# Altium schematic sheet Sensor.SchDoc
size A2
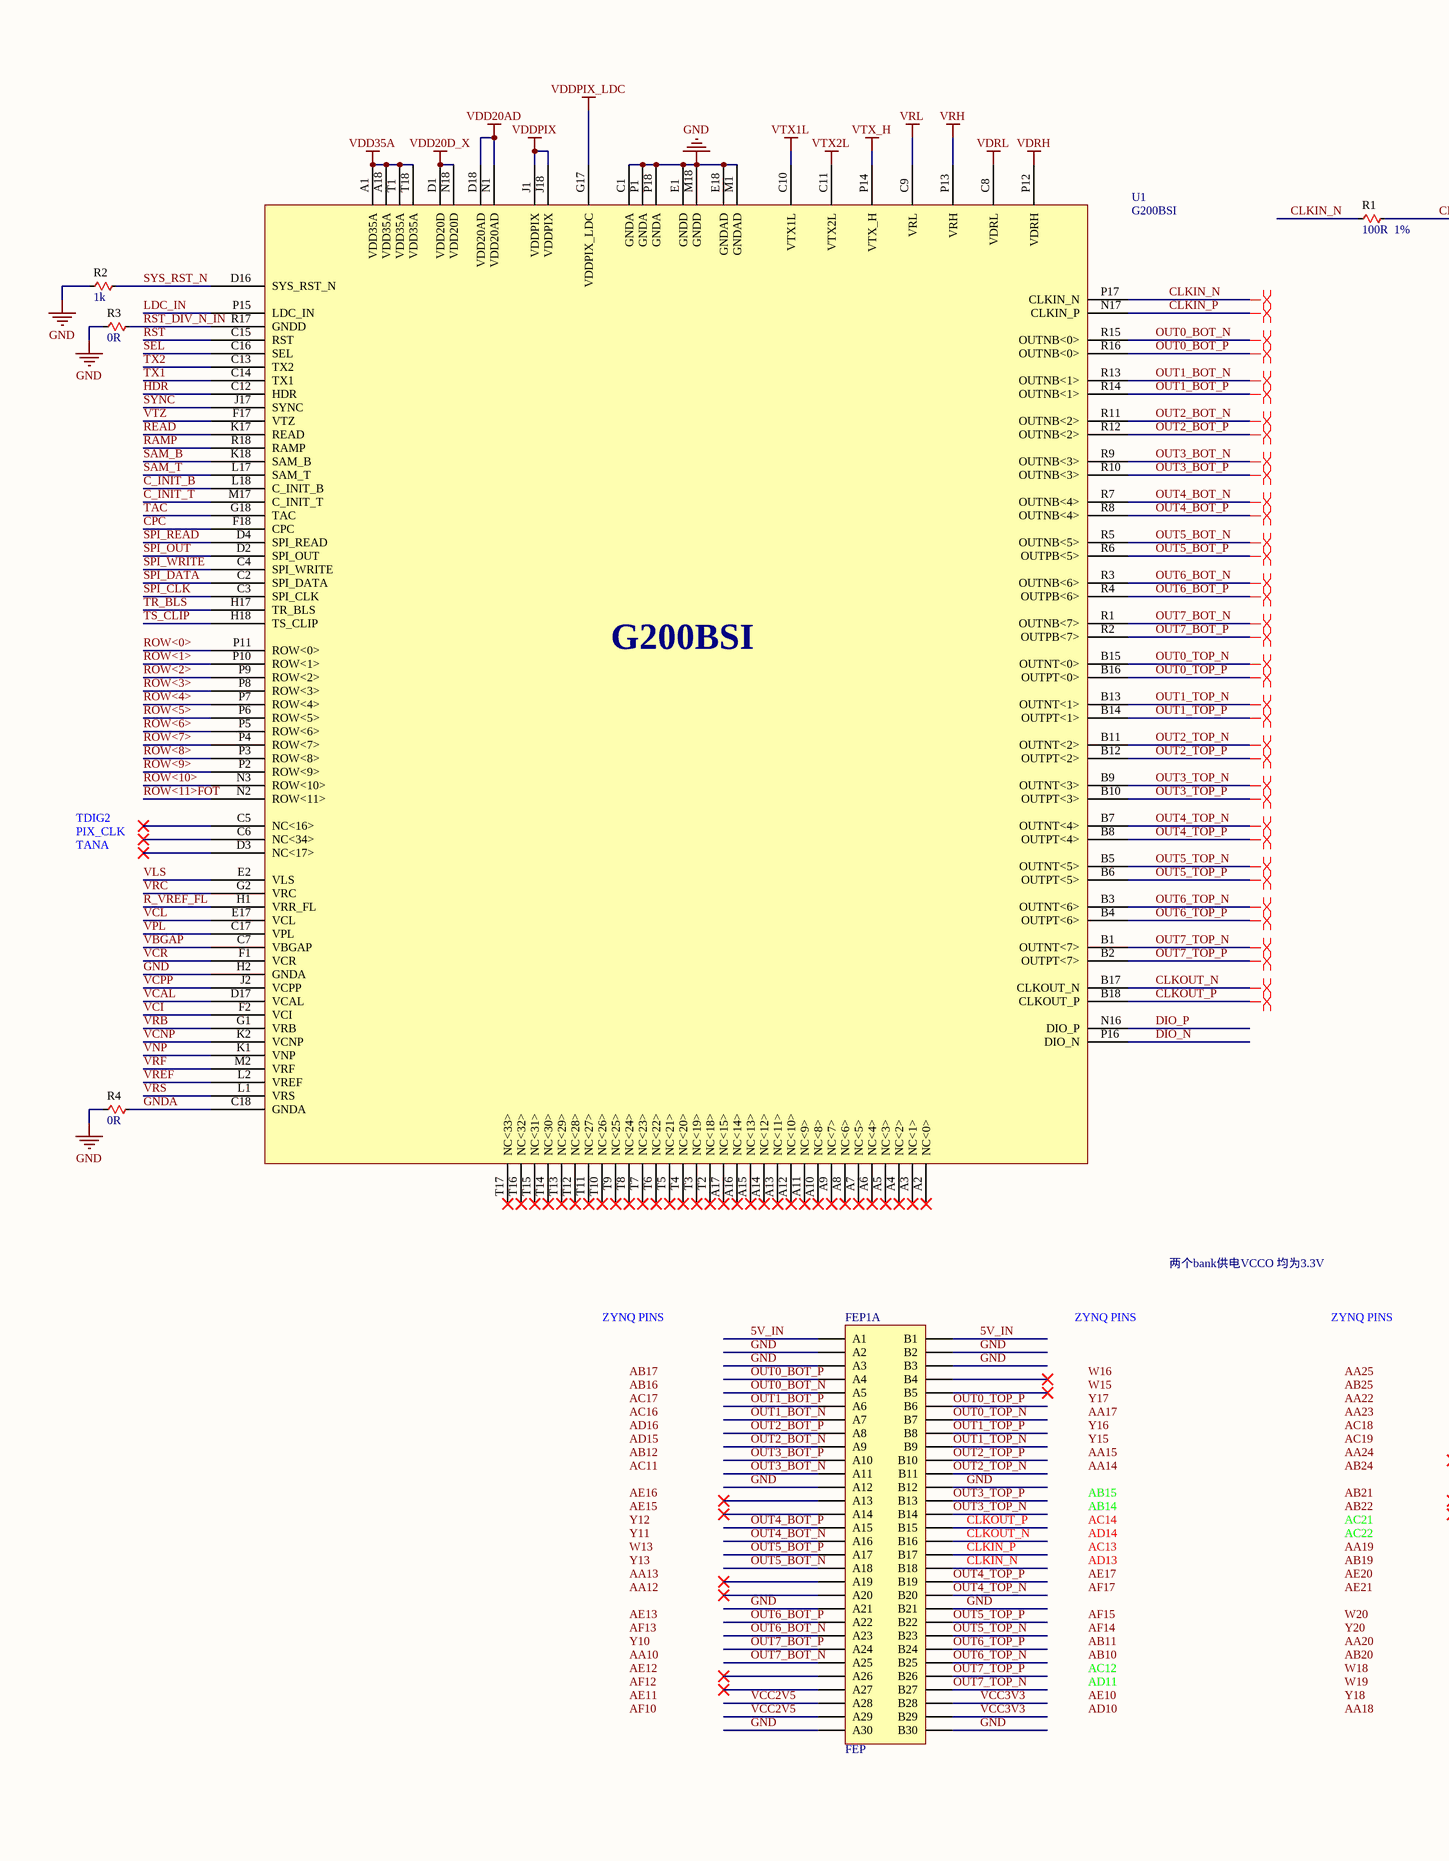
[diagram p0: Sensor.SchDoc, left]
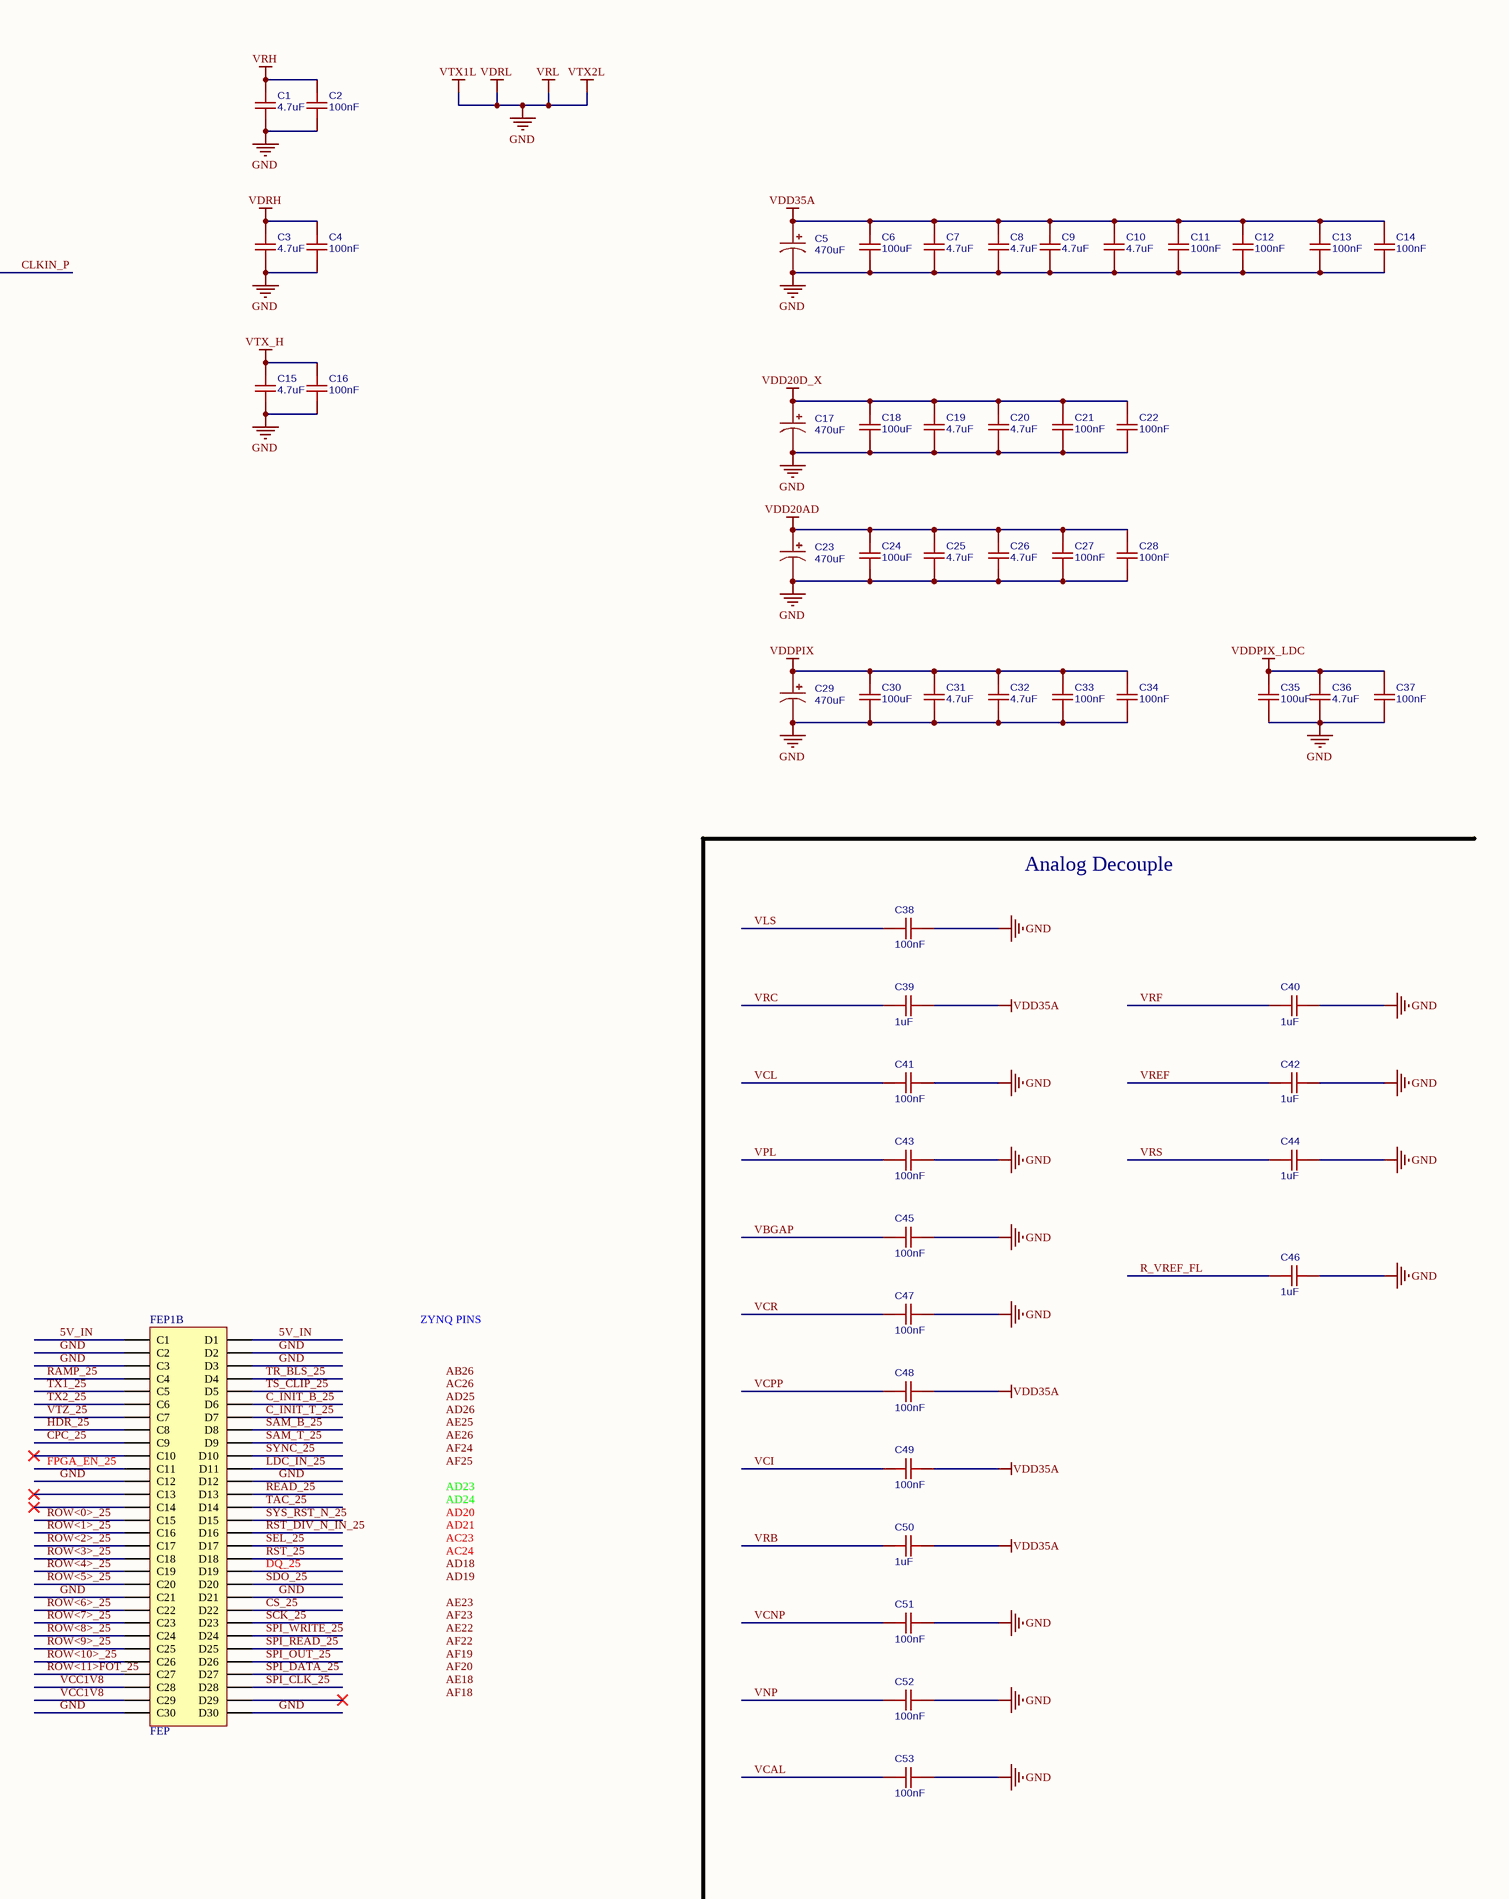
[diagram p1: Sensor.SchDoc, right]

## Parts
C1  4.7uF  [CAP0402]
C2  100nF  [CAP0402]
C3  4.7uF  [CAP0402]
C4  100nF  [CAP0402]
C5  470uF  [CASE-A_3216]
C6  100uF  [CAP0402]
C7  4.7uF  [CAP0402]
C8  4.7uF  [CAP0402]
C9  4.7uF  [CAP0402]
C10  4.7uF  [CAP0402]
C11  100nF  [CAP0402]
C12  100nF  [CAP0402]
C13  100nF  [CAP0402]
C14  100nF  [CAP0402]
C15  4.7uF  [CAP0402]
C16  100nF  [CAP0402]
C17  470uF  [CASE-A_3216]
C18  100uF  [CAP0402]
C19  4.7uF  [CAP0402]
C20  4.7uF  [CAP0402]
C21  100nF  [CAP0402]
C22  100nF  [CAP0402]
C23  470uF  [CASE-A_3216]
C24  100uF  [CAP0402]
C25  4.7uF  [CAP0402]
C26  4.7uF  [CAP0402]
C27  100nF  [CAP0402]
C28  100nF  [CAP0402]
C29  470uF  [CASE-A_3216]
C30  100uF  [CAP0402]
C31  4.7uF  [CAP0402]
C32  4.7uF  [CAP0402]
C33  100nF  [CAP0402]
C34  100nF  [CAP0402]
C35  100uF  [CAP0402]
C36  4.7uF  [CAP0402]
C37  100nF  [CAP0402]
C38  100nF  [CAP0402]
C39  1uF  [CAP0402]
C40  1uF  [CAP0402]
C41  100nF  [CAP0402]
C42  1uF  [CAP0402]
C43  100nF  [CAP0402]
C44  1uF  [CAP0402]
C45  100nF  [CAP0402]
C46  1uF  [CAP0402]
C47  100nF  [CAP0402]
C48  100nF  [CAP0402]
C49  100nF  [CAP0402]
C50  1uF  [CAP0402]
C51  100nF  [CAP0402]
C52  100nF  [CAP0402]
C53  100nF  [CAP0402]
FEP1  FEP  [FEP-X2]  (parts A,B of 3)
R1  100R  1%  [RES0402]
R2  1k  [RES0402]
R3  0R  [RES0402]
R4  0R  [RES0402]
U1  G200BSI  [ANDON Socket]

## Nets
GND: C1.1 C2.1 C3.1 C4.1 C5.2 C6.1 C7.1 C8.1 C9.1 C10.1 C11.1 C12.1 C13.1 C14.1 C15.1 C16.1 C17.2 C18.1 C19.1 C20.1 C21.1 C22.1 C23.2 C24.1 C25.1 C26.1 C27.1 C28.1 C29.2 C30.1 C31.1 C32.1 C33.1 C34.1 C35.1 C36.1 C37.1 C38.2 C40.2 C41.2 C42.2 C43.2 C44.2 C45.2 C46.2 C47.2 C51.2 C52.2 C53.2 FEP1.A2 FEP1.A3 FEP1.A12 FEP1.A21 FEP1.A30 FEP1.B2 FEP1.B3 FEP1.B12 FEP1.B21 FEP1.B30 FEP1.C2 FEP1.C3 FEP1.C12 FEP1.C21 FEP1.C30 FEP1.D2 FEP1.D3 FEP1.D12 FEP1.D21 FEP1.D30 R2.2 R3.2 R4.2 U1.C1(GNDA) U1.C8(VDRL) U1.C9(VRL) U1.C10(VTX1L) U1.C11(VTX2L) U1.E1(GNDD) U1.E18(GNDAD) U1.H2(GNDA) U1.M1(GNDAD) U1.M18(GNDD) U1.P1(GNDA) U1.P18(GNDA)  [also labelled VDRL, VRL, VTX1L, VTX2L]
VDD20AD: C23.1 C24.2 C25.2 C26.2 C27.2 C28.2 U1.D18(VDD20AD) U1.N1(VDD20AD)
VDD20D_X: C17.1 C18.2 C19.2 C20.2 C21.2 C22.2 U1.D1(VDD20D) U1.N18(VDD20D)
VDD35A: C5.1 C6.2 C7.2 C8.2 C9.2 C10.2 C11.2 C12.2 C13.2 C14.2 C39.2 C48.2 C49.2 C50.2 U1.A1(VDD35A) U1.A18(VDD35A) U1.T1(VDD35A) U1.T18(VDD35A)
VDDPIX: C29.1 C30.2 C31.2 C32.2 C33.2 C34.2 U1.J1(VDDPIX) U1.J18(VDDPIX)
VDDPIX_LDC: C35.2 C36.2 C37.2 U1.G17(VDDPIX_LDC)
VDRH: C3.2 C4.2 U1.P12(VDRH)
VRH: C1.2 C2.2 U1.P13(VRH)
VTX_H: C15.2 C16.2 U1.P14(VTX_H)
5V_IN: FEP1.A1 FEP1.B1 FEP1.C1 FEP1.D1
C_INIT_B: U1.L18(C_INIT_B)
C_INIT_B_25: FEP1.D6
C_INIT_T: U1.M17(C_INIT_T)
C_INIT_T_25: FEP1.D7
CLKIN_N: FEP1.B18 R1.2 U1.P17(CLKIN_N)
CLKIN_P: FEP1.B17 R1.1 U1.N17(CLKIN_P)
CLKOUT_N: FEP1.B16 U1.B17(CLKOUT_N)
CLKOUT_P: FEP1.B15 U1.B18(CLKOUT_P)
CPC: U1.F18(CPC)
CPC_25: FEP1.C9
CS_25: FEP1.D22
DIO_N: U1.P16(DIO_N)
DIO_P: U1.N16(DIO_P)
DQ_25: FEP1.D19
FPGA_EN_25: FEP1.C11
GNDA: R4.1 U1.C18(GNDA)
HDR: U1.C12(HDR)
HDR_25: FEP1.C8
LDC_IN: U1.P15(LDC_IN)
LDC_IN_25: FEP1.D11
OUT0_BOT_N: FEP1.A5 U1.R15(OUTNB<0>)
OUT0_BOT_P: FEP1.A4 U1.R16(OUTNB<0>)
OUT0_TOP_N: FEP1.B7 U1.B15(OUTNT<0>)
OUT0_TOP_P: FEP1.B6 U1.B16(OUTPT<0>)
OUT1_BOT_N: FEP1.A7 U1.R13(OUTNB<1>)
OUT1_BOT_P: FEP1.A6 U1.R14(OUTNB<1>)
OUT1_TOP_N: FEP1.B9 U1.B13(OUTNT<1>)
OUT1_TOP_P: FEP1.B8 U1.B14(OUTPT<1>)
OUT2_BOT_N: FEP1.A9 U1.R11(OUTNB<2>)
OUT2_BOT_P: FEP1.A8 U1.R12(OUTNB<2>)
OUT2_TOP_N: FEP1.B11 U1.B11(OUTNT<2>)
OUT2_TOP_P: FEP1.B10 U1.B12(OUTPT<2>)
OUT3_BOT_N: FEP1.A11 U1.R9(OUTNB<3>)
OUT3_BOT_P: FEP1.A10 U1.R10(OUTNB<3>)
OUT3_TOP_N: FEP1.B14 U1.B9(OUTNT<3>)
OUT3_TOP_P: FEP1.B13 U1.B10(OUTPT<3>)
OUT4_BOT_N: FEP1.A16 U1.R7(OUTNB<4>)
OUT4_BOT_P: FEP1.A15 U1.R8(OUTNB<4>)
OUT4_TOP_N: FEP1.B20 U1.B7(OUTNT<4>)
OUT4_TOP_P: FEP1.B19 U1.B8(OUTPT<4>)
OUT5_BOT_N: FEP1.A18 U1.R5(OUTNB<5>)
OUT5_BOT_P: FEP1.A17 U1.R6(OUTPB<5>)
OUT5_TOP_N: FEP1.B23 U1.B5(OUTNT<5>)
OUT5_TOP_P: FEP1.B22 U1.B6(OUTPT<5>)
OUT6_BOT_N: FEP1.A23 U1.R3(OUTNB<6>)
OUT6_BOT_P: FEP1.A22 U1.R4(OUTPB<6>)
OUT6_TOP_N: FEP1.B25 U1.B3(OUTNT<6>)
OUT6_TOP_P: FEP1.B24 U1.B4(OUTPT<6>)
OUT7_BOT_N: FEP1.A25 U1.R1(OUTNB<7>)
OUT7_BOT_P: FEP1.A24 U1.R2(OUTPB<7>)
OUT7_TOP_N: FEP1.B27 U1.B1(OUTNT<7>)
OUT7_TOP_P: FEP1.B26 U1.B2(OUTPT<7>)
R_VREF_FL: C46.1 U1.H1(VRR_FL)
RAMP: U1.R18(RAMP)
RAMP_25: FEP1.C4
READ: U1.K17(READ)
READ_25: FEP1.D13
ROW<0>: U1.P11(ROW<0>)
ROW<0>_25: FEP1.C15
ROW<1>: U1.P10(ROW<1>)
ROW<1>_25: FEP1.C16
ROW<2>: U1.P9(ROW<2>)
ROW<2>_25: FEP1.C17
ROW<3>: U1.P8(ROW<3>)
ROW<3>_25: FEP1.C18
ROW<4>: U1.P7(ROW<4>)
ROW<4>_25: FEP1.C19
ROW<5>: U1.P6(ROW<5>)
ROW<5>_25: FEP1.C20
ROW<6>: U1.P5(ROW<6>)
ROW<6>_25: FEP1.C22
ROW<7>: U1.P4(ROW<7>)
ROW<7>_25: FEP1.C23
ROW<8>: U1.P3(ROW<8>)
ROW<8>_25: FEP1.C24
ROW<9>: U1.P2(ROW<9>)
ROW<9>_25: FEP1.C25
ROW<10>: U1.N3(ROW<10>)
ROW<10>_25: FEP1.C26
ROW<11>FOT: U1.N2(ROW<11>)
ROW<11>FOT_25: FEP1.C27
RST: U1.C15(RST)
RST_25: FEP1.D18
RST_DIV_N_IN: R3.1 U1.R17(GNDD)
RST_DIV_N_IN_25: FEP1.D16
SAM_B: U1.K18(SAM_B)
SAM_B_25: FEP1.D8
SAM_T: U1.L17(SAM_T)
SAM_T_25: FEP1.D9
SCK_25: FEP1.D23
SDO_25: FEP1.D20
SEL: U1.C16(SEL)
SEL_25: FEP1.D17
SPI_CLK: U1.C3(SPI_CLK)
SPI_CLK_25: FEP1.D28
SPI_DATA: U1.C2(SPI_DATA)
SPI_DATA_25: FEP1.D27
SPI_OUT: U1.D2(SPI_OUT)
SPI_OUT_25: FEP1.D26
SPI_READ: U1.D4(SPI_READ)
SPI_READ_25: FEP1.D25
SPI_WRITE: U1.C4(SPI_WRITE)
SPI_WRITE_25: FEP1.D24
SYNC: U1.J17(SYNC)
SYNC_25: FEP1.D10
SYS_RST_N: R2.1 U1.D16(SYS_RST_N)
SYS_RST_N_25: FEP1.D15
TAC: U1.G18(TAC)
TAC_25: FEP1.D14
TR_BLS: U1.H17(TR_BLS)
TR_BLS_25: FEP1.D4
TS_CLIP: U1.H18(TS_CLIP)
TS_CLIP_25: FEP1.D5
TX1: U1.C14(TX1)
TX1_25: FEP1.C5
TX2: U1.C13(TX2)
TX2_25: FEP1.C6
VBGAP: C45.1 U1.C7(VBGAP)
VCAL: C53.1 U1.D17(VCAL)
VCC1V8: FEP1.C28 FEP1.C29
VCC2V5: FEP1.A28 FEP1.A29
VCC3V3: FEP1.B28 FEP1.B29
VCI: C49.1 U1.F2(VCI)
VCL: C41.1 U1.E17(VCL)
VCNP: C51.1 U1.K2(VCNP)
VCPP: C48.1 U1.J2(VCPP)
VCR: C47.1 U1.F1(VCR)
VLS: C38.1 U1.E2(VLS)
VNP: C52.1 U1.K1(VNP)
VPL: C43.1 U1.C17(VPL)
VRB: C50.1 U1.G1(VRB)
VRC: C39.1 U1.G2(VRC)
VREF: C42.1 U1.L2(VREF)
VRF: C40.1 U1.M2(VRF)
VRS: C44.1 U1.L1(VRS)
VTZ: U1.F17(VTZ)
VTZ_25: FEP1.C7

Not connected (* = marked no-connect by the designer): FEP1 A13* A14* A19* A20* A26* A27* B4* B5* C10* C13* C14* D29*; U1 A2(NC<0>)* A3(NC<1>)* A4(NC<2>)* A5(NC<3>)* A6(NC<4>)* A7(NC<5>)* A8(NC<6>)* A9(NC<7>)* A10(NC<8>)* A11(NC<9>)* A12(NC<10>)* A13(NC<11>)* A14(NC<12>)* A15(NC<13>)* A16(NC<14>)* A17(NC<15>)* C5(NC<16>)* C6(NC<34>)* D3(NC<17>)* T2(NC<18>)* T3(NC<19>)* T4(NC<20>)* T5(NC<21>)* T6(NC<22>)* T7(NC<23>)* T8(NC<24>)* T9(NC<25>)* T10(NC<26>)* T11(NC<27>)* T12(NC<28>)* T13(NC<29>)* T14(NC<30>)* T15(NC<31>)* T16(NC<32>)* T17(NC<33>)*

## Layout directives
differential pair: CLKIN_N, CLKIN_P, CLKOUT_N, CLKOUT_P, OUT0_BOT_N, OUT0_BOT_P, OUT0_TOP_N, OUT0_TOP_P, OUT1_BOT_N, OUT1_BOT_P, OUT1_TOP_N, OUT1_TOP_P, OUT2_BOT_N, OUT2_BOT_P, OUT2_TOP_N, OUT2_TOP_P, OUT3_BOT_N, OUT3_BOT_P, OUT3_TOP_N, OUT3_TOP_P, OUT4_BOT_N, OUT4_BOT_P, OUT4_TOP_N, OUT4_TOP_P, OUT5_BOT_N, OUT5_BOT_P, OUT5_TOP_N, OUT5_TOP_P, OUT6_BOT_N, OUT6_BOT_P, OUT6_TOP_N, OUT6_TOP_P, OUT7_BOT_N, OUT7_BOT_P, OUT7_TOP_N, OUT7_TOP_P

## Notes on the sheet
- Analog Decouple
- 两个bank供电VCCO 均为3.3V
- Labels drawn without touching a wire or pin: AA10, AA12, AA13, AA14, AA15, AA17, AA18, AA19, AA20, AA22, AA23, AA24, AA25, AB10, AB11, AB12, AB14, AB15, AB16, AB17, AB19, AB20, AB21, AB22, AB24, AB25, AB26, AC11, AC12, AC13, AC14, AC16, AC17, AC18, AC19, AC21, AC22, AC23, AC24, AC26, AD10, AD11, AD13, AD14, AD15, AD16, AD18, AD19, AD20, AD21, AD23, AD24, AD25, AD26, AE10, AE11, AE12, AE13, AE15, AE16, AE17, AE18, AE20, AE21, AE22, AE23, AE25, AE26, AF10, AF12, AF13, AF14, AF15, AF17, AF18, AF19, AF20, AF22, AF23, AF24, AF25, PIX_CLK, TANA, TDIG2, W13, W15, W16, W18, W19, W20, Y10, Y11, Y12, Y13, Y15, Y16, Y17, Y18, Y20, ZYNQ PINS

## Library data of the parts
C1 C3 C7-C10 C15 C19 C20 C25 C26 C31 C32 C36 = 4.7u: nameAlias: Value(F); Contributor: LCEDA_Lib; spicePre: C; spiceSymbolName: C_0603_US
C2 C4 C6 C11-C14 C16 C18 C21 C22 C24 C27 C28 C30 C33-C35 C37 C38 C41 C43 C45 C47-C49 C51-C53 = 100n: nameAlias: Value(F); Contributor: LCEDA_Lib; spicePre: C; spiceSymbolName: C_0603_US
C5 C17 C23 C29 = 150u: nameAlias: Value(F); Contributor: LCEDA_Lib; spicePre: C; spiceSymbolName: C_Tan_SMD_A_US
C39 C40 C42 C44 C46 C50 = 1u: nameAlias: Value(F); Contributor: LCEDA_Lib; spicePre: C; spiceSymbolName: C_0603_US
FEP1 = FEP-2X
R1-R4 = RESISTOR: Generic Resistor; Value: 10K; Manufacturer: *; DPN: *